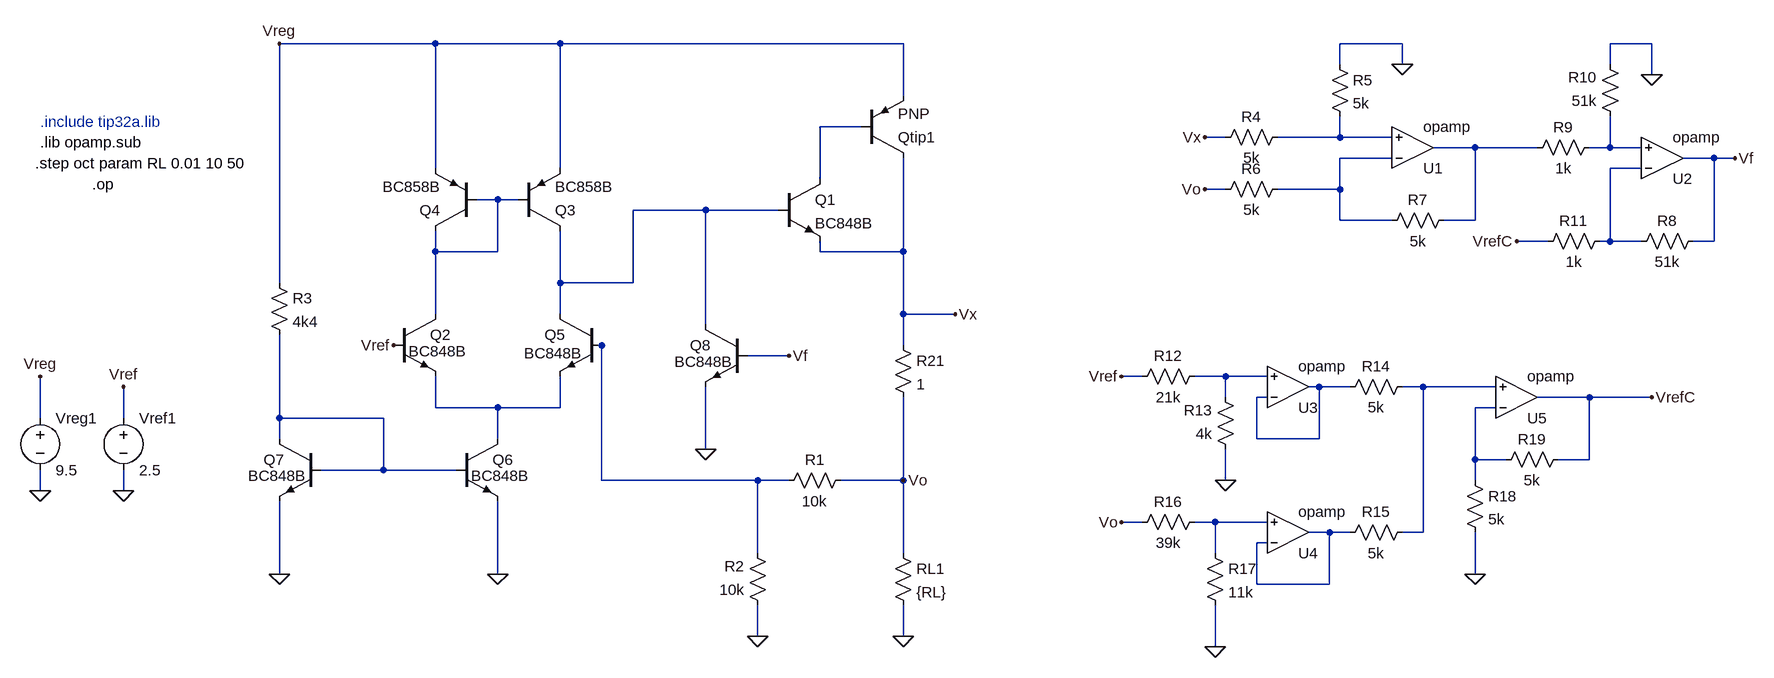
[diagram p0: schematic Foldback_5_opamps.asc]
Foldback_5_opamps.asc, the LTspice schematic file:
Version 4
SHEET 1 2312 952
WIRE 272 -144 32 -144
WIRE 464 -144 272 -144
WIRE 992 -144 464 -144
WIRE 1760 -144 1664 -144
WIRE 2144 -144 2080 -144
WIRE 1664 -112 1664 -144
WIRE 1760 -112 1760 -144
WIRE 2080 -112 2080 -144
WIRE 2144 -96 2144 -144
WIRE 992 -64 992 -144
WIRE 928 -16 864 -16
WIRE 1488 0 1456 0
WIRE 1664 0 1664 -32
WIRE 1664 0 1568 0
WIRE 1744 0 1664 0
WIRE 1872 16 1808 16
WIRE 1968 16 1872 16
WIRE 2080 16 2080 -32
WIRE 2080 16 2048 16
WIRE 2128 16 2080 16
WIRE 1744 32 1664 32
WIRE 2240 32 2192 32
WIRE 2272 32 2240 32
WIRE 272 48 272 -144
WIRE 464 48 464 -144
WIRE 2128 48 2080 48
WIRE 864 64 864 -16
WIRE 1488 80 1456 80
WIRE 1664 80 1664 32
WIRE 1664 80 1568 80
WIRE 368 96 336 96
WIRE 400 96 368 96
WIRE 688 112 576 112
WIRE 800 112 688 112
WIRE 1664 128 1664 80
WIRE 1744 128 1664 128
WIRE 1872 128 1872 16
WIRE 1872 128 1824 128
WIRE 1984 160 1936 160
WIRE 2080 160 2080 48
WIRE 2080 160 2064 160
WIRE 2128 160 2080 160
WIRE 2240 160 2240 32
WIRE 2240 160 2208 160
WIRE 272 176 272 144
WIRE 368 176 368 96
WIRE 368 176 272 176
WIRE 864 176 864 160
WIRE 992 176 992 32
WIRE 992 176 864 176
WIRE 32 224 32 -144
WIRE 464 224 464 144
WIRE 576 224 576 112
WIRE 576 224 464 224
WIRE 272 272 272 176
WIRE 464 272 464 224
WIRE 992 272 992 176
WIRE 1072 272 992 272
WIRE 688 288 688 112
WIRE 528 320 512 320
WIRE 992 320 992 272
WIRE 816 336 752 336
WIRE 1360 368 1328 368
WIRE 1488 368 1440 368
WIRE 1552 368 1488 368
WIRE 1632 384 1616 384
WIRE 1680 384 1632 384
WIRE 1792 384 1760 384
WIRE 1904 384 1792 384
WIRE 1488 400 1488 368
WIRE 1552 400 1536 400
WIRE 2048 400 1968 400
WIRE 2144 400 2048 400
WIRE 272 416 272 368
WIRE 368 416 272 416
WIRE 464 416 464 368
WIRE 464 416 368 416
WIRE 1904 416 1872 416
WIRE -336 432 -336 368
WIRE -208 432 -208 384
WIRE 32 432 32 304
WIRE 192 432 32 432
WIRE 32 464 32 432
WIRE 368 464 368 416
WIRE 1536 464 1536 400
WIRE 1632 464 1632 384
WIRE 1632 464 1536 464
WIRE 688 480 688 384
WIRE 1872 496 1872 416
WIRE 1920 496 1872 496
WIRE 2048 496 2048 400
WIRE 2048 496 2000 496
WIRE 192 512 192 432
WIRE 192 512 96 512
WIRE 304 512 192 512
WIRE 528 528 528 320
WIRE 768 528 528 528
WIRE 816 528 768 528
WIRE 992 528 992 400
WIRE 992 528 896 528
WIRE 1488 528 1488 480
WIRE 1872 528 1872 496
WIRE -336 544 -336 512
WIRE -208 544 -208 512
WIRE 1360 592 1328 592
WIRE 1472 592 1440 592
WIRE 1552 592 1472 592
WIRE 1648 608 1616 608
WIRE 1680 608 1648 608
WIRE 1792 608 1792 384
WIRE 1792 608 1760 608
WIRE 1552 624 1536 624
WIRE 768 640 768 528
WIRE 992 640 992 528
WIRE 1472 640 1472 592
WIRE 32 672 32 560
WIRE 368 672 368 560
WIRE 1872 672 1872 608
WIRE 1536 688 1536 624
WIRE 1648 688 1648 608
WIRE 1648 688 1536 688
WIRE 768 768 768 720
WIRE 992 768 992 720
WIRE 1472 784 1472 720
FLAG 368 672 0
FLAG 32 672 0
FLAG 992 768 0
FLAG 768 768 0
FLAG -208 544 0
FLAG 208 320 Vref
FLAG -208 384 Vref
FLAG -336 544 0
FLAG -336 368 Vreg
FLAG 32 -144 Vreg
FLAG 992 528 Vo
FLAG 1072 272 Vx
FLAG 1760 -112 0
FLAG 1456 0 Vx
FLAG 1456 80 Vo
FLAG 1936 160 VrefC
FLAG 2144 -96 0
FLAG 2272 32 Vf
FLAG 688 480 0
FLAG 816 336 Vf
FLAG 1472 784 0
FLAG 1488 528 0
FLAG 1872 672 0
FLAG 1328 368 Vref
FLAG 1328 592 Vo
FLAG 2144 400 VrefC
SYMBOL npn 800 64 R0
SYMATTR InstName Q1
SYMATTR Value BC848B
SYMBOL npn 208 272 R0
WINDOW 3 23 57 Left 2
SYMATTR Value BC848B
SYMATTR InstName Q2
SYMBOL pnp 400 144 M180
SYMATTR InstName Q3
SYMATTR Value BC858B
SYMBOL pnp 336 144 R180
SYMATTR InstName Q4
SYMATTR Value BC858B
SYMBOL npn 528 272 M0
WINDOW 3 30 60 Left 2
SYMATTR Value BC848B
SYMATTR InstName Q5
SYMBOL npn 304 464 R0
WINDOW 3 23 57 Left 2
SYMATTR Value BC848B
SYMATTR InstName Q6
SYMBOL npn 96 464 M0
WINDOW 3 23 57 Left 2
SYMATTR Value BC848B
SYMATTR InstName Q7
SYMBOL res 912 512 R90
WINDOW 0 0 56 VBottom 2
WINDOW 3 32 56 VTop 2
SYMATTR InstName R1
SYMATTR Value 10k
SYMBOL res 784 736 R180
WINDOW 0 36 76 Left 2
WINDOW 3 36 40 Left 2
SYMATTR InstName R2
SYMATTR Value 10k
SYMBOL res 16 208 R0
SYMATTR InstName R3
SYMATTR Value 4k4
SYMBOL voltage -208 416 R0
WINDOW 123 0 0 Left 0
WINDOW 39 0 0 Left 0
SYMATTR InstName Vref1
SYMATTR Value 2.5
SYMBOL voltage -336 416 R0
WINDOW 123 0 0 Left 0
WINDOW 39 0 0 Left 0
SYMATTR InstName Vreg1
SYMATTR Value 9.5
SYMBOL res 976 624 R0
SYMATTR InstName RL1
SYMATTR Value {RL}
SYMBOL pnp 928 32 M180
SYMATTR InstName Qtip1
SYMBOL OpAmps\\opamp 1776 80 M180
SYMATTR InstName U1
SYMBOL res 1584 -16 R90
WINDOW 0 0 56 VBottom 2
WINDOW 3 32 56 VTop 2
SYMATTR InstName R4
SYMATTR Value 5k
SYMBOL res 1648 -128 R0
SYMATTR InstName R5
SYMATTR Value 5k
SYMBOL res 1584 64 R90
WINDOW 0 0 56 VBottom 2
WINDOW 3 32 56 VTop 2
SYMATTR InstName R6
SYMATTR Value 5k
SYMBOL res 1728 144 R270
WINDOW 0 32 56 VTop 2
WINDOW 3 0 56 VBottom 2
SYMATTR InstName R7
SYMATTR Value 5k
SYMBOL OpAmps\\opamp 2160 96 M180
SYMATTR InstName U2
SYMBOL res 2224 144 R90
WINDOW 0 0 56 VBottom 2
WINDOW 3 32 56 VTop 2
SYMATTR InstName R8
SYMATTR Value 51k
SYMBOL res 2064 0 R90
WINDOW 0 0 56 VBottom 2
WINDOW 3 32 56 VTop 2
SYMATTR InstName R9
SYMATTR Value 1k
SYMBOL res 2096 -16 R180
WINDOW 0 36 76 Left 2
WINDOW 3 36 40 Left 2
SYMATTR InstName R10
SYMATTR Value 51k
SYMBOL res 1968 176 R270
WINDOW 0 32 56 VTop 2
WINDOW 3 0 56 VBottom 2
SYMATTR InstName R11
SYMATTR Value 1k
SYMBOL npn 752 288 M0
WINDOW 3 23 57 Left 2
SYMATTR Value BC848B
SYMATTR InstName Q8
SYMBOL OpAmps\\opamp 1584 448 M180
SYMATTR InstName U3
SYMBOL OpAmps\\opamp 1584 672 M180
SYMATTR InstName U4
SYMBOL OpAmps\\opamp 1936 464 M180
SYMATTR InstName U5
SYMBOL res 1456 352 R90
WINDOW 0 0 56 VBottom 2
WINDOW 3 32 56 VTop 2
SYMATTR InstName R12
SYMATTR Value 21k
SYMBOL res 1504 496 R180
WINDOW 0 36 76 Left 2
WINDOW 3 36 40 Left 2
SYMATTR InstName R13
SYMATTR Value 4k
SYMBOL res 1664 400 R270
WINDOW 0 32 56 VTop 2
WINDOW 3 0 56 VBottom 2
SYMATTR InstName R14
SYMATTR Value 5k
SYMBOL res 1664 624 R270
WINDOW 0 32 56 VTop 2
WINDOW 3 0 56 VBottom 2
SYMATTR InstName R15
SYMATTR Value 5k
SYMBOL res 1344 608 R270
WINDOW 0 32 56 VTop 2
WINDOW 3 0 56 VBottom 2
SYMATTR InstName R16
SYMATTR Value 39k
SYMBOL res 1456 624 R0
SYMATTR InstName R17
SYMATTR Value 11k
SYMBOL res 1856 512 R0
SYMATTR InstName R18
SYMATTR Value 5k
SYMBOL res 2016 480 R90
WINDOW 0 0 56 VBottom 2
WINDOW 3 32 56 VTop 2
SYMATTR InstName R19
SYMATTR Value 5k
SYMBOL res 976 304 R0
SYMATTR InstName R21
SYMATTR Value 1
TEXT -256 72 Left 2 !.op
TEXT -344 40 Left 2 !.step oct param RL 0.01 10 50
TEXT -336 -24 Left 2 ;.include tip32a.lib
TEXT -336 8 Left 2 !.lib opamp.sub

The netlist it stands for:
* Foldback_5_opamps.asc
Q1 N001 N008 Vx 0 BC848B
Q2 N007 Vref N013 0 BC848B
Q3 N008 N007 Vreg 0 BC858B
Q4 N007 N007 Vreg 0 BC858B
Q5 N008 N009 N013 0 BC848B
Q6 N013 N015 0 0 BC848B
Q7 N015 N015 0 0 BC848B
R1 Vo N009 10k
R2 0 N009 10k
R3 Vreg N015 4k4
Vref1 Vref 0 2.5
Vreg1 Vreg 0 9.5
RL1 Vo 0 {RL}
Qtip1 Vx N001 Vreg 0 PNP
XU1 N005 N002 N003 opamp Aol=100K GBW=10Meg  ; pins invin noninvin out
R4 N002 Vx 5k
R5 0 N002 5k
R6 N005 Vo 5k
R7 N005 N003 5k
XU2 N006 N004 Vf opamp Aol=100K GBW=10Meg  ; pins invin noninvin out
R8 Vf N006 51k
R9 N004 N003 1k
R10 N004 0 51k
R11 VrefC N006 1k
Q8 N008 Vf 0 0 BC848B
XU3 N011 N010 N011 opamp Aol=100K GBW=10Meg  ; pins invin noninvin out
XU4 N017 N016 N017 opamp Aol=100K GBW=10Meg  ; pins invin noninvin out
XU5 N014 N012 VrefC opamp Aol=100K GBW=10Meg  ; pins invin noninvin out
R12 N010 Vref 21k
R13 0 N010 4k
R14 N011 N012 5k
R15 N017 N012 5k
R16 Vo N016 39k
R17 N016 0 11k
R18 N014 0 5k
R19 VrefC N014 5k
R21 Vx Vo 1
.model NPN NPN
.model PNP PNP
.lib standard.bjt
.op
.step oct param RL 0.01 10 50
* .include tip32a.lib
.lib opamp.sub
.backanno
.end